# Altium schematic sheet CameraInterface.SchDoc: Camera Interface Schematic
size A; DrawnBy: Mike Mozingo; Engineer: Mike Mozingo; Revision: 1; DocumentName: Camera Interface Schematic; ProjectName: eyeCU
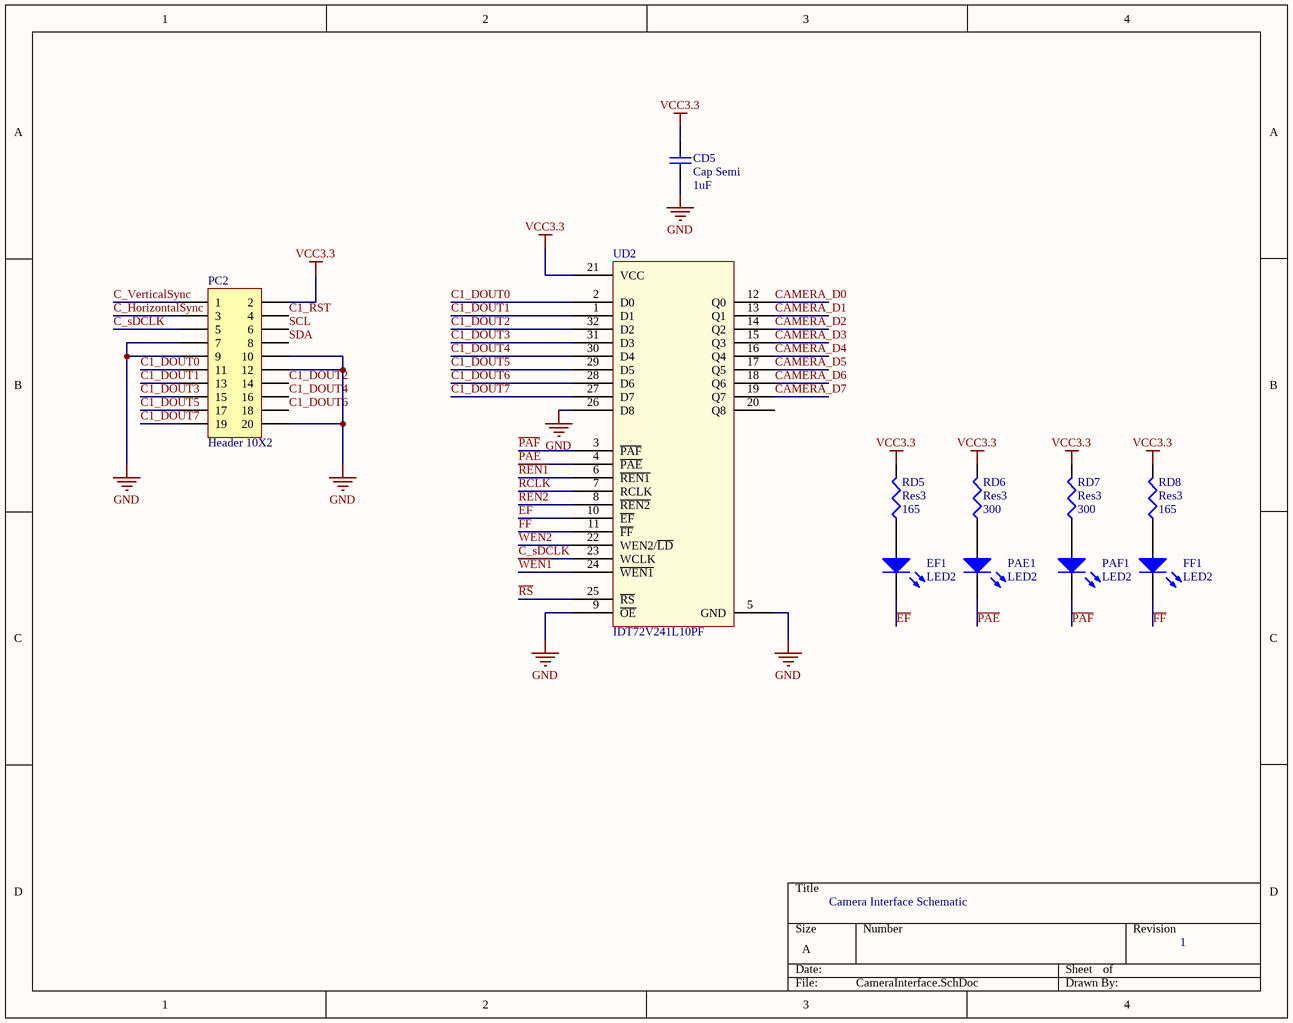
[diagram p0: CameraInterface.SchDoc]

## Parts
CD5  Cap Semi  value 1uF  [CAPC1608L]
EF1  LED2  [DIODE1608]
FF1  LED2  [DIODE1608]
PAE1  LED2  [DIODE1608]
PAF1  LED2  [DIODE1608]
PC2  Header 10X2  [HDR2X10]
RD5  Res3  value 165  [RESC1608L]
RD6  Res3  value 300  [RESC1608L]
RD7  Res3  value 300  [RESC1608L]
RD8  Res3  value 165  [RESC1608L]
UD2  IDT72V241L10PF  [IDT72V241L10PF]

## Nets
GND: CD5.1 PC2.7 PC2.9 PC2.10 PC2.12 PC2.20 UD2.5(GND) UD2.9(~{OE}) UD2.26(D8)
VCC3.3: CD5.2 PC2.2 RD5.2 RD6.2 RD7.2 RD8.2 UD2.21(VCC)
~{REN1}: UD2.6(~{REN1})
~{REN2}: UD2.8(~{REN2})
~{RS}: UD2.25(~{RS})
~{WEN1}: UD2.24(~{WEN1})
C1_DOUT0: PC2.11 UD2.2(D0)
C1_DOUT1: PC2.13 UD2.1(D1)
C1_DOUT2: PC2.14 UD2.32(D2)
C1_DOUT3: PC2.15 UD2.31(D3)
C1_DOUT4: PC2.16 UD2.30(D4)
C1_DOUT5: PC2.17 UD2.29(D5)
C1_DOUT6: PC2.18 UD2.28(D6)
C1_DOUT7: PC2.19 UD2.27(D7)
C1_RST: PC2.4
C_HorizontalSync: PC2.3
C_sDCLK: PC2.5 UD2.23(WCLK)
C_VerticalSync: PC2.1
CAMERA_D0: UD2.12(Q0)
CAMERA_D1: UD2.13(Q1)
CAMERA_D2: UD2.14(Q2)
CAMERA_D3: UD2.15(Q3)
CAMERA_D4: UD2.16(Q4)
CAMERA_D5: UD2.17(Q5)
CAMERA_D6: UD2.18(Q6)
CAMERA_D7: UD2.19(Q7)
~{EF}: EF1.2(K) UD2.10(~{EF})
~{FF}: FF1.2(K) UD2.11(~{FF})
~{PAE}: PAE1.2(K) UD2.4(~{PAE})
~{PAF}: PAF1.2(K) UD2.3(~{PAF})
RCLK: UD2.7(RCLK)
SCL: PC2.6
SDA: PC2.8
WEN2: UD2.22(WEN2/~{LD})
NetEF1_1: EF1.1(A) RD5.1
NetFF1_1: FF1.1(A) RD8.1
NetPAE1_1: PAE1.1(A) RD6.1
NetPAF1_1: PAF1.1(A) RD7.1

Not connected (* = marked no-connect by the designer): UD2 20(Q8)

## Library data of the parts
CD5 = Cap Semi: Capacitor (Semiconductor SIM Model); Published: 8-Jun-2000; LatestRevisionDate: 29-May-2009; LatestRevisionNote: IPC-7351 Footprint Added.; PackageReference: C1206; Publisher: Altium Limited; PackageDescription: Chip Capacitor
EF1 FF1 PAE1 PAF1 = LED2: Typical RED, GREEN, YELLOW, AMBER GaAs LED; Published: 8-Jun-2000; LatestRevisionDate: 17-Jul-2002; LatestRevisionNote: Re-released for DXP Platform.; PackageVersion: Feb-2002; PackageReference: 3.2X1.6X1.1; Publisher: Altium Limited
  EF1: Color: Green
  FF1: Color: Red
  PAE1 PAF1: Color: Amber
PC2 = Header 10X2: Header, 10-Pin, Dual row; LatestRevisionDate: 17-Jul-2002; LatestRevisionNote: Re-released for DXP Platform.; Publisher: Altium Limited
RD5-RD8 = Res3: Resistor; Published: 8-Jun-2000; LatestRevisionDate: 29-May-2009; LatestRevisionNote: IPC-7351 Footprint Added.; PackageReference: J1-0603; Publisher: Altium Limited; PackageDescription: Chip Resistor
UD2 = IDT72V241L10PF: 36K (4K x 9) FIFO Buffer